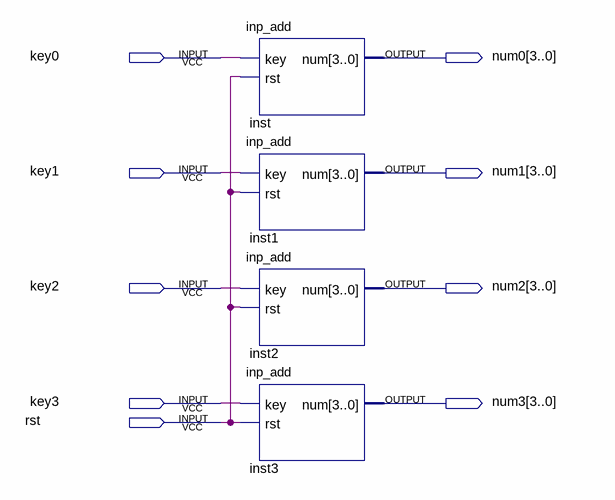
[diagram p0: schematic sheet]
// Quartus schematic inp_add_4by4.bdf as structural Verilog: 4 symbols, 9 pins
module inp_add_4by4 (
  input  key0,
  input  key1,
  input  key2,
  input  key3,
  input  rst,
  output [3:0] num0,
  output [3:0] num1,
  output [3:0] num2,
  output [3:0] num3
);

  inp_add inst (.key(key0), .rst(rst), .num(num0));
  inp_add inst1 (.key(key1), .rst(rst), .num(num1));
  inp_add inst2 (.key(key2), .rst(rst), .num(num2));
  inp_add inst3 (.key(key3), .rst(rst), .num(num3));
endmodule
